# Altium schematic sheet CorroSenseBoard_V4_DaugtherBoard.SchDoc
size A4; SheetNumber: 1; SheetTotal: 3
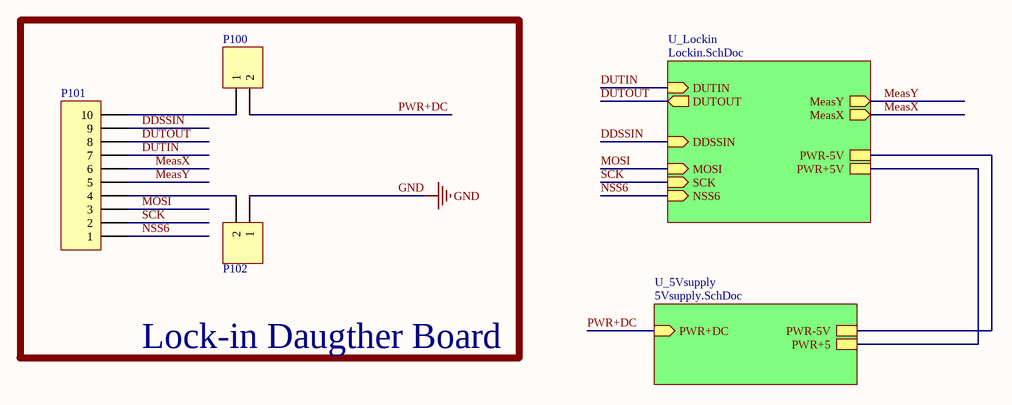
[diagram p0: CorroSenseBoard_V4_DaugtherBoard.SchDoc]

## Parts
P100  Header, 2-Pin  [HDR1X2]  (value not drawn)
P101  Header, 10-Pin  [HDR1X10]  (value not drawn)
P102  Header, 2-Pin  [HDR1X2]  (value not drawn)

## Blocks framed on the sheet
Lock-in Daugther Board: P100-P102

## Sub-sheets
U_5Vsupply = 5Vsupply.SchDoc: PWR+DC (in), PWR-5V, PWR+5
U_Lockin = Lockin.SchDoc: DUTIN (in), DDSSIN (in), PWR-5V, PWR+5V, MeasY (out), DUTOUT (out), MOSI (in), SCK (in), NSS6 (in), MeasX (out)

## Nets
GND: P102.1
DDSSIN: P101.9 ; sheet U_Lockin/DDSSIN
DUTIN: P101.7 ; sheet U_Lockin/DUTIN
DUTOUT: P101.8 ; sheet U_Lockin/DUTOUT
MeasX: P101.6 ; sheet U_Lockin/MeasX
MeasY: P101.5 ; sheet U_Lockin/MeasY
MOSI: P101.3 ; sheet U_Lockin/MOSI
NSS6: P101.1 ; sheet U_Lockin/NSS6
PWR+DC: P100.2 ; sheet U_5Vsupply/PWR+DC
SCK: P101.2 ; sheet U_Lockin/SCK
NetP100_1: P100.1 P101.10
NetP101_4: P101.4 P102.2
(unnamed): sheet U_5Vsupply/PWR-5V, sheet U_Lockin/PWR-5V
(unnamed): sheet U_5Vsupply/PWR+5, sheet U_Lockin/PWR+5V

## Library data of the parts
P100 P102 = Header 2: Manufacturer: Wurth Elektronik; MPN: 61300211121; LatestRevisionDate: 17-Jul-2002; LatestRevisionNote: Re-released for DXP Platform.; Publisher: Altium Limited
P101 = Header 10: Manufacturer: Wurth Elektronik; MPN: 61301011121; LatestRevisionDate: 17-Jul-2002; LatestRevisionNote: Re-released for DXP Platform.; Publisher: Altium Limited